# EAGLE design ClockBoard (EAGLE 7.5.0)
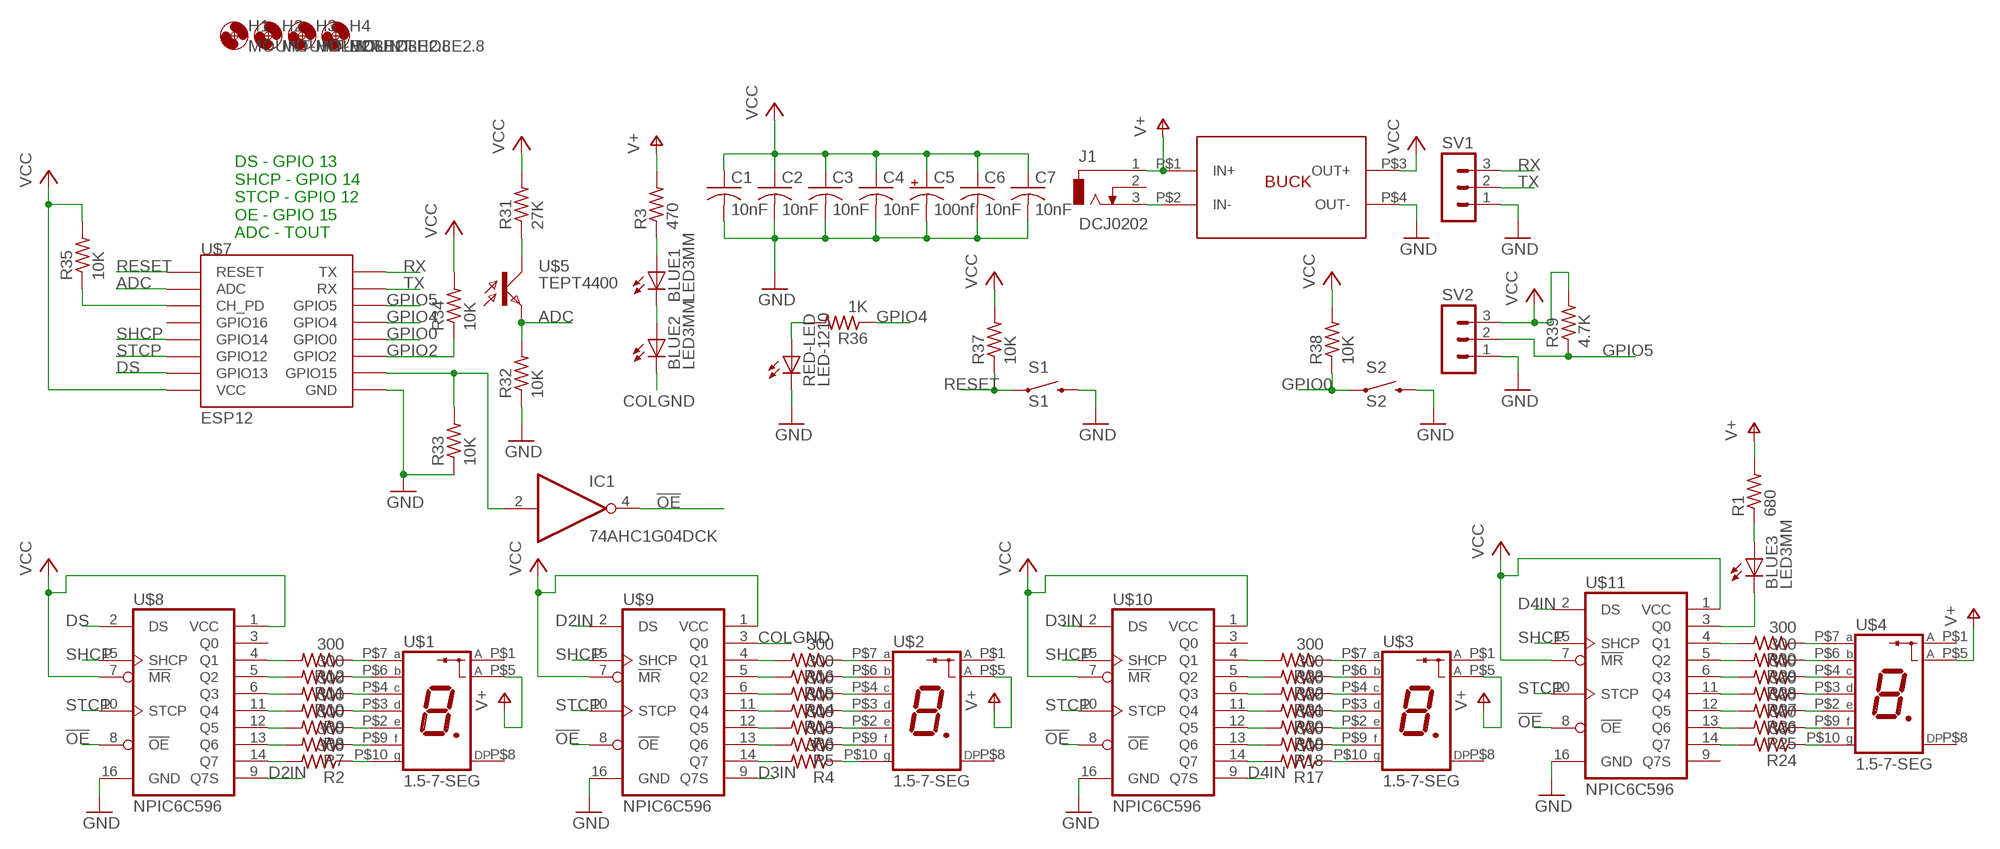
[diagram p0: schematic, sheet 1]

## Parts
B1  BUCK_CONV  [BUCK_CONV]
BLUE1  LED3MM  [LED3MM]
BLUE2  LED3MM  [LED3MM]
BLUE3  LED3MM  [LED3MM]
C1  10nF  C-USC0805K  [C0805K]
C2  10nF  C-USC0805K  [C0805K]
C3  10nF  C-USC0805K  [C0805K]
C4  10nF  C-USC0805K  [C0805K]
C5  100nf  CPOL-USE5-4  [E5-4]
C6  10nF  C-US050-025X075  [C050-025X075]
C7  10nF  C-USC0805K  [C0805K]
H1  MOUNT-HOLE2.8  [2,8]
H2  MOUNT-HOLE2.8  [2,8]
H3  MOUNT-HOLE2.8  [2,8]
H4  MOUNT-HOLE2.8  [2,8]
IC1  74AHC1G04DCK  [SC70-5]
J1  DCJ0202  [DCJ0202]
R1  680  R-US_M0805  [M0805]
R2  300  R-US_M0805  [M0805]
R3  470  R-US_M0805  [M0805]
R4  300  R-US_M0805  [M0805]
R5  300  R-US_M0805  [M0805]
R6  300  R-US_M0805  [M0805]
R7  300  R-US_M0805  [M0805]
R8  300  R-US_M0805  [M0805]
R9  300  R-US_M0805  [M0805]
R10  300  R-US_M0805  [M0805]
R11  300  R-US_M0805  [M0805]
R12  300  R-US_M0805  [M0805]
R13  300  R-US_M0805  [M0805]
R14  300  R-US_M0805  [M0805]
R15  300  R-US_M0805  [M0805]
R16  300  R-US_M0805  [M0805]
R17  300  R-US_M0805  [M0805]
R18  300  R-US_M0805  [M0805]
R19  300  R-US_M0805  [M0805]
R20  300  R-US_M0805  [M0805]
R21  300  R-US_M0805  [M0805]
R22  300  R-US_M0805  [M0805]
R23  300  R-US_M0805  [M0805]
R24  300  R-US_M0805  [M0805]
R25  300  R-US_M0805  [M0805]
R26  300  R-US_M0805  [M0805]
R27  300  R-US_M0805  [M0805]
R28  300  R-US_M0805  [M0805]
R29  300  R-US_M0805  [M0805]
R30  300  R-US_M0805  [M0805]
R31  27K  R-US_M0805  [M0805]
R32  10K  R-US_M0805  [M0805]
R33  10K  R-US_M0805  [M0805]
R34  10K  R-US_M0805  [M0805]
R35  10K  R-US_M0805  [M0805]
R36  1K  R-US_M0805  [M0805]
R37  10K  R-US_M0805  [M0805]
R38  10K  R-US_M0805  [M0805]
R39  4.7K  R-US_M0805  [M0805]
RED-LED  LED-1210  [C1210K]
S1  S1  SWITCH-MOMENTARY-2PTH  [TACTILE-PTH]
S2  S2  SWITCH-MOMENTARY-2PTH  [TACTILE-PTH]
SV1  MA03-1  [MA03-1]
SV2  MA03-1  [MA03-1]
U$1  1.5-7-SEG  [1.5-7-SEG]
U$2  1.5-7-SEG  [1.5-7-SEG]
U$3  1.5-7-SEG  [1.5-7-SEG]
U$4  1.5-7-SEG  [1.5-7-SEG]
U$5  TEPT4400  [T1]
U$7  ESP12  [ESP12]
U$8  NPIC6C596  [SO16]
U$9  NPIC6C596  [SO16]
U$10  NPIC6C596  [SO16]
U$11  NPIC6C596  [SO16]

## Nets
!OE: IC1.4(O) U$8.8(!OE) U$9.8(!OE) U$10.8(!OE) U$11.8(!OE)
ADC: R32.2 U$5.A(E) U$7.ADC
COLGND: BLUE2.K(C) U$9.3(Q0)
D2IN: U$8.9(Q7S) U$9.2(DS)
D3IN: U$9.9(Q7S) U$10.2(DS)
D4IN: U$10.9(Q7S) U$11.2(DS)
DS: U$7.GPIO13 U$8.2(DS)
GND: B1.P$4(OUT-) C1.2 C2.2 C3.2 C4.2 C5.- C6.2 C7.2 R32.1 R33.1 RED-LED.2(C) S1.3 S2.3 SV1.1 SV2.1 U$7.GND U$8.16(GND) U$9.16(GND) U$10.16(GND) U$11.16(GND)
GPIO0: R38.1 S2.1 U$7.GPIO0
GPIO2: R34.1 U$7.GPIO2
GPIO4: R36.1 U$7.GPIO4
GPIO5: R39.1 SV2.2 U$7.GPIO5
N$1: R12.2 U$8.4(Q1)
N$2: BLUE3.A R1.1
N$3: BLUE1.A R3.1
N$4: BLUE1.K(C) BLUE2.A
N$5: R12.1 U$1.P$7(A)
N$6: R11.2 U$8.5(Q2)
N$7: R11.1 U$1.P$6(B)
N$8: R10.2 U$8.6(Q3)
N$9: R10.1 U$1.P$4(C)
N$10: R9.2 U$8.11(Q4)
N$11: R9.1 U$1.P$3(D)
N$12: R8.2 U$8.12(Q5)
N$13: R8.1 U$1.P$2(E)
N$14: R7.2 U$8.13(Q6)
N$15: R7.1 U$1.P$9(F)
N$16: R2.2 U$8.14(Q7)
N$17: R2.1 U$1.P$10(G)
N$18: R23.2 U$10.4(Q1)
N$19: R16.1 U$2.P$7(A)
N$20: R22.2 U$10.5(Q2)
N$21: R31.1 U$5.K(C)
N$22: R15.1 U$2.P$6(B)
N$23: R21.2 U$10.6(Q3)
N$24: R14.1 U$2.P$4(C)
N$25: R16.2 U$9.4(Q1)
N$26: R13.1 U$2.P$3(D)
N$27: R15.2 U$9.5(Q2)
N$28: R6.1 U$2.P$2(E)
N$29: R14.2 U$9.6(Q3)
N$30: R5.1 U$2.P$9(F)
N$31: R13.2 U$9.11(Q4)
N$32: R4.1 U$2.P$10(G)
N$33: R20.2 U$10.11(Q4)
N$34: R23.1 U$3.P$7(A)
N$35: R19.2 U$10.12(Q5)
N$36: R22.1 U$3.P$6(B)
N$37: R18.2 U$10.13(Q6)
N$38: R21.1 U$3.P$4(C)
N$39: R17.2 U$10.14(Q7)
N$40: R20.1 U$3.P$3(D)
N$41: R30.2 U$11.4(Q1)
N$42: R19.1 U$3.P$2(E)
N$43: R29.2 U$11.5(Q2)
N$44: R18.1 U$3.P$9(F)
N$45: R28.2 U$11.6(Q3)
N$46: R17.1 U$3.P$10(G)
N$47: R27.2 U$11.11(Q4)
N$48: R30.1 U$4.P$7(A)
N$49: R26.2 U$11.12(Q5)
N$50: R29.1 U$4.P$6(B)
N$51: R25.2 U$11.13(Q6)
N$52: R28.1 U$4.P$4(C)
N$53: R24.2 U$11.14(Q7)
N$54: R27.1 U$4.P$3(D)
N$56: R26.1 U$4.P$2(E)
N$57: R36.2 RED-LED.1(A)
N$58: R25.1 U$4.P$9(F)
N$59: B1.P$2(IN-) J1.3
N$60: R24.1 U$4.P$10(G)
N$61: BLUE3.K(C) U$11.3(Q0)
N$62: R6.2 U$9.12(Q5)
N$63: R5.2 U$9.13(Q6)
N$64: R4.2 U$9.14(Q7)
N$65: IC1.2(I) R33.2 U$7.GPIO15
N$68: R35.1 U$7.CH_PD
RESET: R37.1 S1.1 U$7.RESET
RX: SV1.3 U$7.TX
SHCP: U$7.GPIO14 U$8.15(SHCP) U$9.15(SHCP) U$10.15(SHCP) U$11.15(SHCP)
STCP: U$7.GPIO12 U$8.10(STCP) U$9.10(STCP) U$10.10(STCP) U$11.10(STCP)
TX: SV1.2 U$7.RX
V+: B1.P$1(IN+) J1.1 R1.2 R3.2 U$1.P$5(A) U$2.P$5(A) U$3.P$5(A) U$4.P$5(A)
VCC: B1.P$3(OUT+) C1.1 C2.1 C3.1 C4.1 C5.+ C6.1 C7.1 R31.2 R34.2 R35.2 R37.2 R38.2 R39.2 SV2.3 U$7.VCC U$8.1(VCC) U$8.7(!MR) U$9.1(VCC) U$9.7(!MR) U$10.1(VCC) U$10.7(!MR) U$11.1(VCC) U$11.7(!MR)
Unconnected: J1.2 U$1.P$1(A) U$1.P$8(DP) U$2.P$1(A) U$2.P$8(DP) U$3.P$1(A) U$3.P$8(DP) U$4.P$1(A) U$4.P$8(DP) U$7.GPIO16 U$8.3(Q0) U$10.3(Q0) U$11.9(Q7S)

## Notes on the sheet
- DS - GPIO 13
  SHCP - GPIO 14
  STCP - GPIO 12
  OE - GPIO 15
  ADC - TOUT

## Power pins joined to a net without a drawn wire
GND: IC1.3(GND)
VCC: IC1.5(VCC)

## Library data of the parts
B1 = KevinsLib:BUCK_CONV
BLUE1-BLUE3 = KevinsLib:LED3MM
C1-C4 C6 C7 = rcl:C-US: CAPACITOR, American symbol
C5 = rcl:CPOL-US: POLARIZED CAPACITOR, American symbol
H1-H4 = holes:MOUNT-HOLE: MOUNTING HOLE with drill center marker
IC1 = 74xx-little-us:74*1G04: INVERTER Gate
J1 = con-jack:DCJ0202: DC POWER JACK Source: DCJ0202.pdf; OC_FARNELL: unknown; OC_NEWARK: unknown
R1-R39 = rcl:R-US_: RESISTOR, American symbol
RED-LED = KevinsLib:LED-1210
S1 S2 = KevinsLib:SWITCH-MOMENTARY-2: Various NO switches- pushbuttons, reed, etc
SV1 SV2 = con-lstb:MA03-1: PIN HEADER; OC_FARNELL: unknown; OC_NEWARK: unknown
U$1-U$4 = KevinsLib:1.5-7-SEG
U$5 = KevinsLib:TEPT4400
U$7 = KevinsLib:ESP12: ESP8266 Wifi module 12
U$8-U$11 = KevinsLib:NPIC6C596

## Board
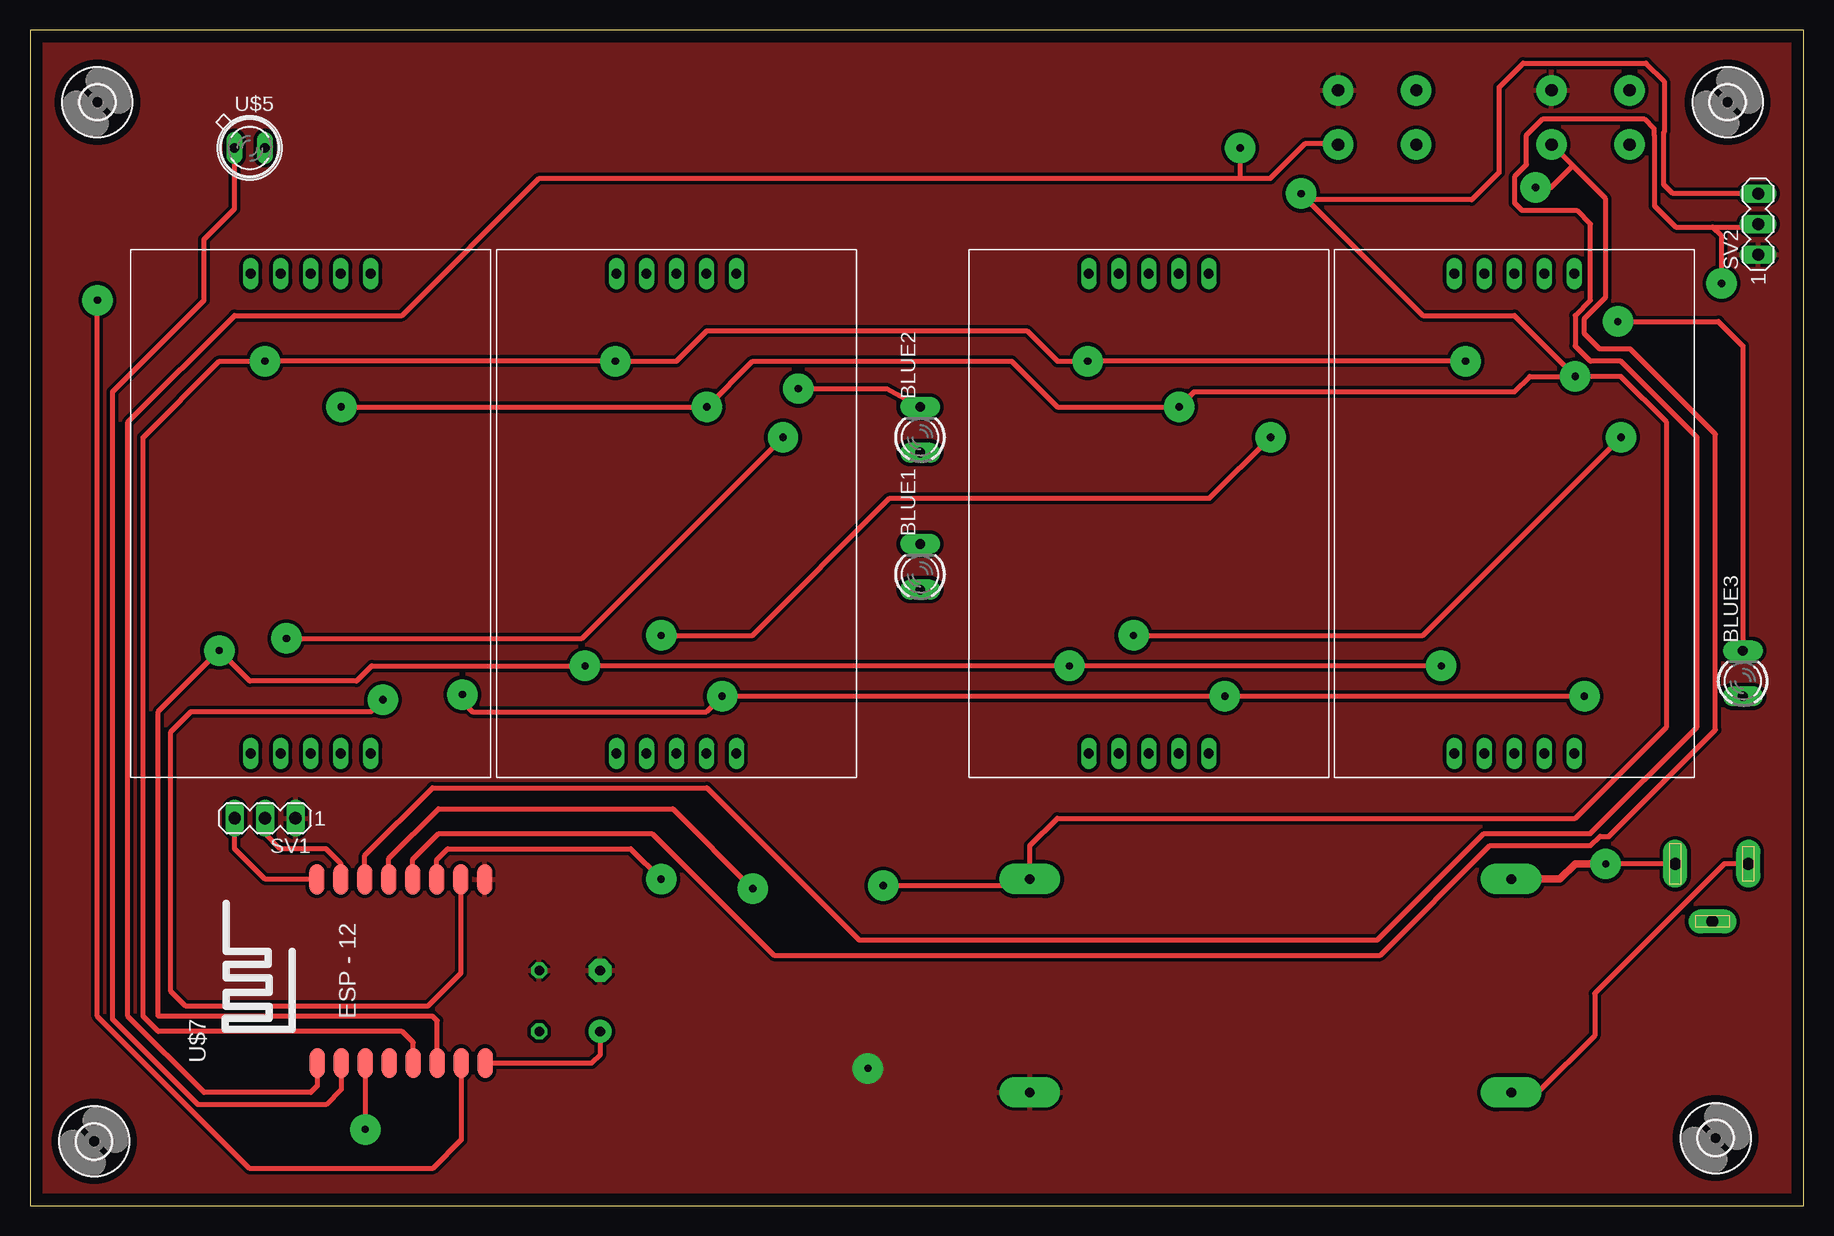
[diagram p1: board, top side]
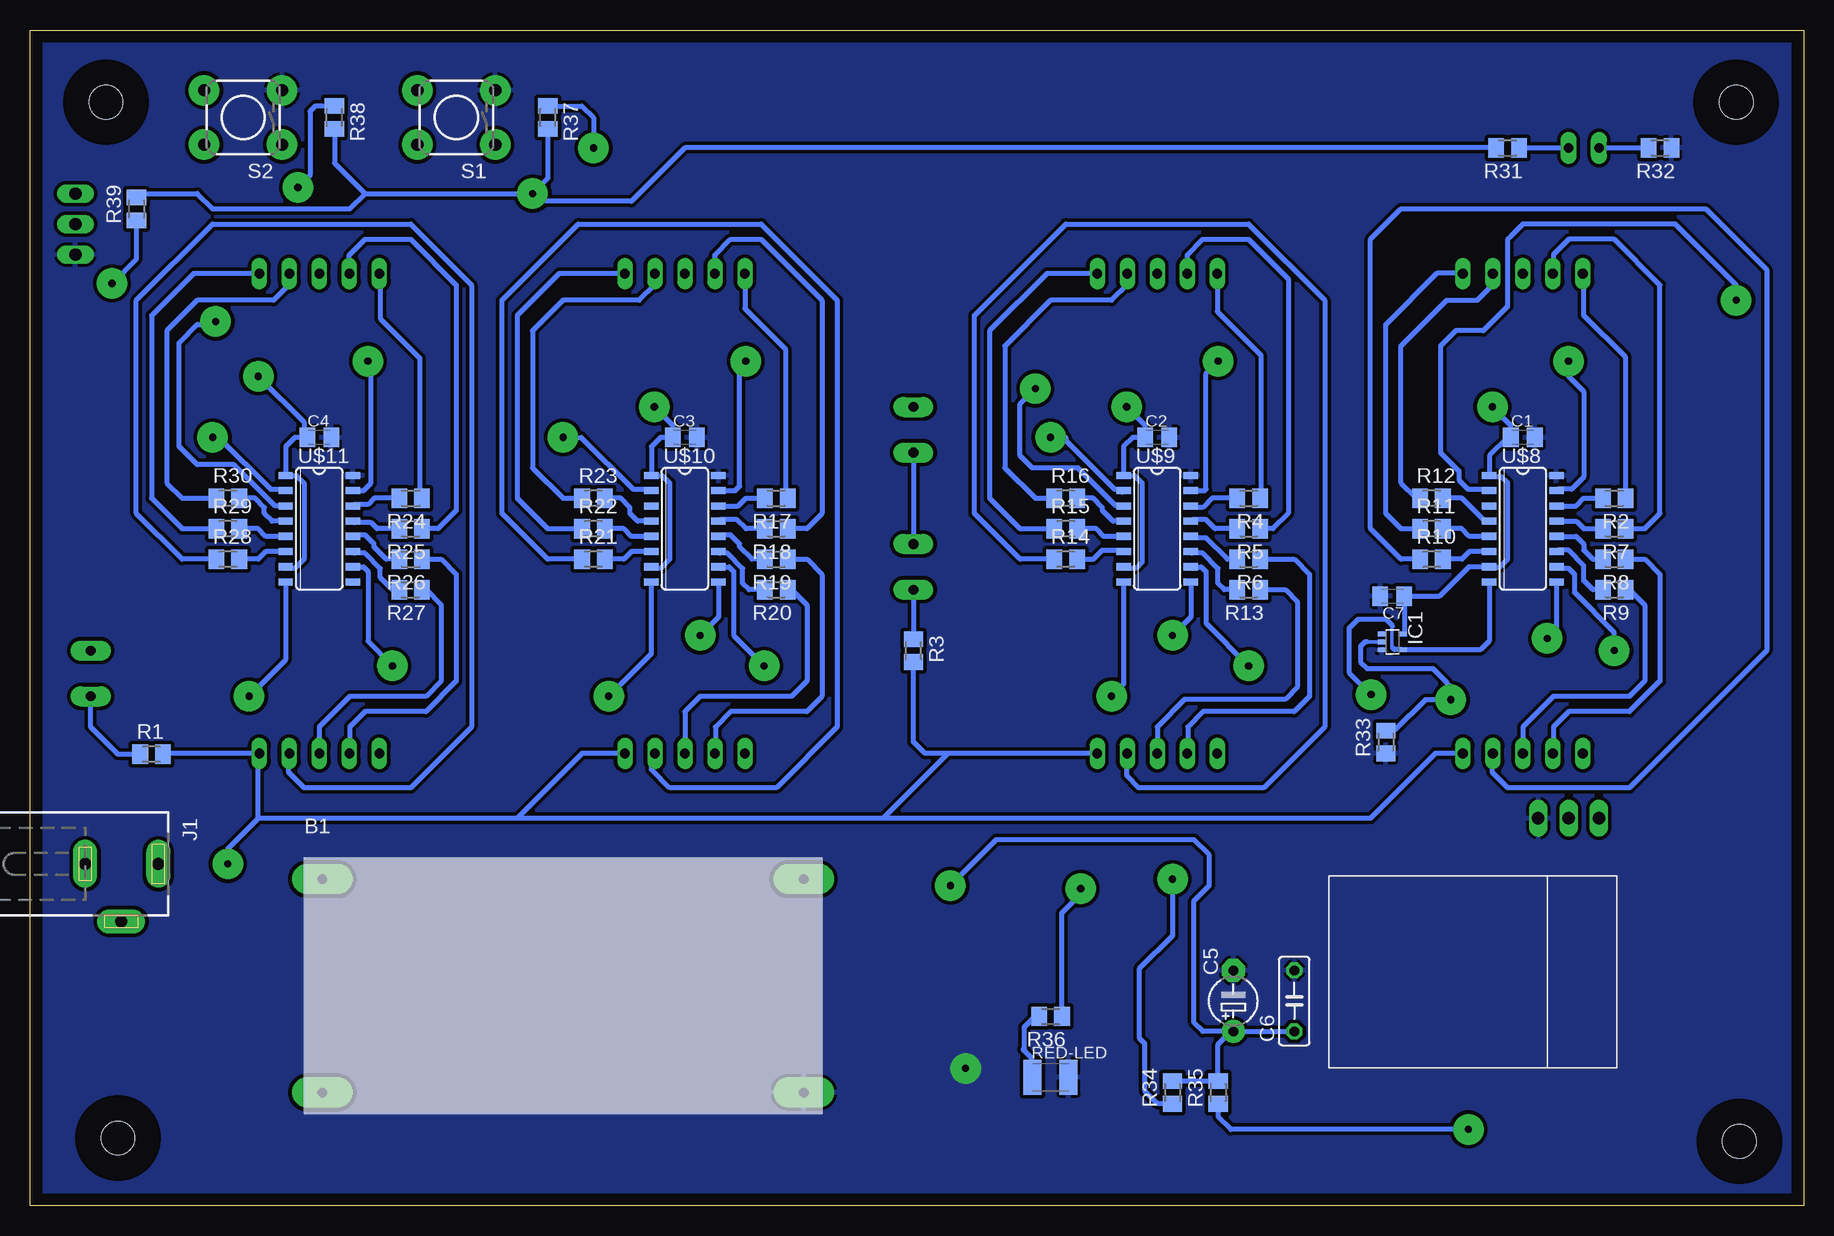
[diagram p2: board, bottom side, seen from below]

Size 147.84 x 98 mm. Coordinates in mm from the lower left corner, seen from the top.
Outline: 0,0 147.84,0 147.84,98 0,98 0,0
Copper layers (1*16): Top 0.035mm / dielectric 1.5mm / Bottom 0.035mm
Design rules "default *": minimum track width 10mil, minimum drill 20mil, track to track 12mil, track to pad 12mil, pad to pad 12mil, via to via 12mil, smd to smd 12mil, copper to edge 40mil, drill to drill 8mil, minimum pad ring 10mil, minimum via ring 8mil, stop-mask expansion 4mil, vias tented up to drill 0mil, thermal gap 10mil

### Footprints (pad centres in the part's own frame; a part is rotated, then mirrored left to right if it is on the bottom)
BUCK_CONV = drill 0.8 pad 2.54 long: P$1 -20.066,8.89; P$2 -20.066,-8.89; P$3 20.066,8.89; P$4 20.066,-8.89
LED3MM = drill 0.813 pad 1.676 long: A -1.27,0; K 2.54,0
C0805K = smd 1.3 x 1.6: 1 -1,0; 2 1,0
E5-4 = drill 0.813 pad 1.905: + -2.54,0 | drill 0.813 pad 1.905 octagon: - 2.54,0
C050-025X075 = drill 0.813 octagon: 1 -2.54,0; 2 2.54,0
2,8 = hole 2.8: 0,0
SC70-5 = smd 0.4 x 0.7: 1 -0.65,-0.85; 2 0,-0.85; 3 0.65,-0.85; 4 0.65,0.85; 5 -0.65,0.85
DCJ0202 = drill 1 pad 2 long: 1 0,3.1; 2 4.8,0; 3 0,-3
M0805 = smd 1.3 x 1.6: 1 -0.95,0; 2 0.95,0
C1210K = smd 1.5 x 2.9: 1 -1.5,0; 2 1.5,0
TACTILE-PTH = drill 1.016 pad 2.54: 1 -3.251,2.261; 2 3.251,2.261; 3 -3.251,-2.261; 4 3.251,-2.261
MA03-1 = drill 1.016 long: 1 -2.54,0; 2 0,0; 3 2.54,0
1.5-7-SEG = drill 0.8 long: P$1 -5,-20; P$2 -2.5,-20; P$3 0,-20; P$4 2.5,-20; P$5 5,-20; P$6 5,20; P$7 2.5,20; P$8 0,20; P$9 -2.5,20; P$10 -5,20
T1 = drill 0.813 long: A -1.27,0; K 1.27,0
ESP12 = smd 2.54 x 1.27: ADC -7.71,3.81; CH_PD -7.71,1.81; GND 7.6,-8.16; GPIO0 7.6,-2.16; GPIO2 7.6,-4.16; GPIO4 7.6,-0.16; GPIO5 7.6,1.84; GPIO12 -7.71,-4.19; GPIO13 -7.71,-6.19; GPIO14 -7.71,-2.19; GPIO15 7.6,-6.16; GPIO16 -7.71,-0.19; RESET -7.71,5.81; RX 7.6,3.84; TX 7.6,5.84; VCC -7.71,-8.19
SO16 = smd 0.6 x 1.2: 1 -4.445,-2.8; 2 -3.175,-2.8; 3 -1.905,-2.8; 4 -0.635,-2.8; 5 0.635,-2.8; 6 1.905,-2.8; 7 3.175,-2.8; 8 4.445,-2.8; 9 4.445,2.8; 10 3.175,2.8; 11 1.905,2.8; 12 0.635,2.8; 13 -0.635,2.8; 14 -1.905,2.8; 15 -3.175,2.8; 16 -4.445,2.8

### Placement (x,y rotation side)
B1  103.41,18.32 0 bottom
BLUE1  74.2,52.61 90 top
BLUE2  74.2,64.04 90 top
BLUE3  142.78,43.72 90 top
C1  23.4,64.04 0 bottom
C2  53.88,64.04 0 bottom
C3  93.25,64.04 0 bottom
C4  123.73,64.04 0 bottom
C5  47.53,17.05 90 bottom
C6  42.45,17.05 90 bottom
C7  34.29,50.8 180 bottom
H1  5.62,91.98 0 top
H2  141.51,91.98 0 top
H3  5.35,5.35 0 top
H4  140.51,5.62 0 top
IC1  34.29,46.99 270 bottom
J1  140.24,28.48 270 bottom
R1  137.7,37.62 0 bottom
R2  15.78,58.96 180 bottom
R3  74.2,46.26 270 bottom
R4  46.26,58.96 180 bottom
R5  46.26,56.42 180 bottom
R6  46.26,53.88 180 bottom
R7  15.78,56.42 180 bottom
R8  15.78,53.88 180 bottom
R9  15.78,51.34 180 bottom
R10  31.02,53.88 0 bottom
R11  31.02,56.42 0 bottom
R12  31.02,58.96 0 bottom
R13  46.26,51.34 180 bottom
R14  61.5,53.88 0 bottom
R15  61.5,56.42 0 bottom
R16  61.5,58.96 0 bottom
R17  85.63,58.96 180 bottom
R18  85.63,56.42 180 bottom
R19  85.63,53.88 180 bottom
R20  85.63,51.34 180 bottom
R21  100.87,53.88 0 bottom
R22  100.87,56.42 0 bottom
R23  100.87,58.96 0 bottom
R24  116.11,58.96 180 bottom
R25  116.11,56.42 180 bottom
R26  116.11,53.88 180 bottom
R27  116.11,51.34 180 bottom
R28  131.35,53.88 0 bottom
R29  131.35,56.42 0 bottom
R30  131.35,58.96 0 bottom
R31  24.67,88.17 180 bottom
R32  11.97,88.17 180 bottom
R33  34.83,38.64 90 bottom
R34  52.61,9.43 90 bottom
R35  48.8,9.43 90 bottom
R36  62.77,15.78 180 bottom
R37  104.68,90.71 270 bottom
R38  122.46,90.71 270 bottom
R39  138.97,83.09 90 bottom
RED-LED  62.77,10.7 0 bottom
S1  112.3,90.71 180 bottom
S2  130.08,90.71 180 bottom
SV1  19.59,32.29 180 top
SV2  144.05,81.82 90 top
U$1  23.4,57.69 0 top
U$2  53.88,57.69 0 top
U$3  93.25,57.69 0 top
U$4  123.73,57.69 0 top
U$5  18.32,88.17 0 top
U$7  29.75,19.59 90 top
U$8  23.4,56.42 270 bottom
U$9  53.88,56.42 270 bottom
U$10  93.25,56.42 270 bottom
U$11  123.73,56.42 270 bottom

### Tracks (layer width: path | path; a pad name or v marks a point on that pad's centre or on a via)
!OE  (via drill 0.6 pad 2.54)
  Top 0.406: v129.57,42.45 v99.6,42.45 v57.69,42.45 56.39,41.15 36.88,41.15 36.04,41.99 v36.04,42.6
  Bottom 0.305: 34.24,46.48 34.24,46.51 34.31,46.58 34.31,48.23 34.24,48.31
  Bottom 0.406: U$9.8 56.68,43.46 v57.69,42.45 | U$10.8 96.05,46 v99.6,42.45 | U$11.8 126.53,45.49 v129.57,42.45 | 34.24,46.48 34.1,46.34 IC1.4 26.95,46.33 26.2,47.08 U$8.8 | 34.24,48.31 34.8,48.87 37.13,48.87 37.9,48.11 37.9,44.45 v36.04,42.6
ADC
  Top 0.406: 25.94,11.97 U$7.ADC 25.94,9.68 24.67,8.41 14,8.41 6.89,15.53 6.89,67.85 14.51,75.47 14.51,80.55 17.05,83.09 U$5.A
  Bottom 0.406: U$5.A R32.2
COLGND  (via drill 0.6 pad 2.54)
  Top 0.406: v64.04,68.1 71.41,68.1 BLUE2.K
  Bottom 0.406: U$9.3 57.31,58.33 60.48,61.5 64.29,61.5 65.31,62.52 65.31,66.83 v64.04,68.1
D2IN  (via drill 0.6 pad 2.54)
  Top 0.406: v21.37,47.28 46.01,47.28 v62.77,64.04
  Bottom 0.406: U$8.9 20.6,48.04 v21.37,47.28 | 56.81,59.47 U$9.2 56.81,59.72 57.44,59.72 61.5,63.79 61.5,64.04 v62.77,64.04
D3IN  (via drill 0.6 pad 2.54)
  Top 0.406: v52.61,47.53 60.23,47.53 71.66,58.96 98.33,58.96 v103.41,64.04
  Bottom 0.406: U$9.9 51.08,49.06 v52.61,47.53 | v103.41,64.04 101.89,64.04 97.57,59.72 96.18,59.72 U$10.2
D4IN  (via drill 0.6 pad 2.54)
  Top 0.406: v91.98,47.53 116.11,47.53 v132.62,64.04
  Bottom 0.406: U$10.9 90.45,49.06 v91.98,47.53 | v132.62,64.04 132.11,64.04 127.79,59.72 126.66,59.72 U$11.2
DS  (via drill 0.6 pad 2.54)
  Top 0.406: U$7.GPIO13 35.94,5.46 33.56,3.08 18.32,3.08 5.62,15.78 v5.62,75.47
  Bottom 0.406: v5.62,75.47 5.62,76.74 10.7,81.82 23.4,81.82 24.42,80.8 24.42,80.79 24.69,80.52 24.69,74.94 26.7,72.93 28.99,72.93 30.26,71.66 30.26,62.77 28.73,61.25 28.73,60.48 27.97,59.72 26.33,59.72 U$8.2
GND  (via drill 0.6 pad 2.54)
  other vias: 69.85,11.43
  pour Top: 0,0 147.32,0 147.32,97.79 0,97.79
  pour Bottom: 0,0 0,97.79 147.32,97.79 147.32,0
GPIO0  (via drill 0.6 pad 2.54)
  Top 0.406: U$7.GPIO0 31.91,28.86 34.07,31.02 51.85,31.02 62.01,20.86 112.55,20.86 121.7,30 130.08,30 130.86,30.79 131.67,30.79 131.67,30.84 140.49,39.66 140.49,64.29 133.38,71.41 130.84,71.41 129.57,72.68 129.57,73.95 131.35,75.72 131.35,83.93 128.59,86.68 | 128.59,86.68 S2.1 | v125.51,84.87 126.78,84.87 128.59,86.68
  Bottom 0.406: R38.1 124.05,91.66 124.49,91.22 124.49,85.88 v125.51,84.87
GPIO2  (via drill 0.6 pad 2.54)
  Top 0.406: U$7.GPIO2 33.91,28.83 34.83,29.75 50.07,29.75 v52.61,27.21
  Bottom 0.406: v52.61,27.21 52.61,22.5 55.4,19.71 55.4,13.99 54.94,13.54 54.94,9.58 53.9,8.53 52.66,8.53 R34.1
GPIO4  (via drill 0.6 pad 2.54)
  Top 0.406: U$7.GPIO4 29.91,28.92 34.06,33.07 53.59,33.07 v60.25,26.42
  Bottom 0.406: v60.25,26.42 60.25,25.96 61.85,24.36 61.85,15.81 R36.1
GPIO5  (via drill 0.6 pad 2.54)
  Top 0.406: U$7.GPIO5 27.91,29.18 33.56,34.83 56.42,34.83 69.12,22.13 112.3,22.13 121.19,31.02 130.08,31.02 138.97,39.91 138.97,64.04 132.62,70.39 130.08,70.39 128.81,71.66 128.81,74.2 130.08,75.47 130.08,81.82 128.94,82.96 124.36,82.96 123.73,83.6 123.73,85.76 124.75,86.77 124.75,89.24 126.11,90.6 134.54,90.6 135.36,89.79 135.36,89.24 135.41,89.19 135.41,83.34 137.19,81.57 140.24,81.57 | 140.24,81.57 143.8,81.57 SV2.2 | v141,76.87 141,80.8 140.24,81.57
  Bottom 0.406: R39.1 138.97,78.9 v141,76.87
N$1
  Bottom 0.406: U$8.4 26.57,57.05 28.48,58.96 R12.2
N$2
  Bottom 0.406: R1.1 140.49,37.62 142.78,39.91 BLUE3.A
N$3
  Bottom 0.406: BLUE1.A R3.1
N$4
  Bottom 0.406: BLUE2.A BLUE1.K
N$5
  Bottom 0.406: R12.1 32.29,58.96 33.56,60.23 33.56,71.66 29.75,75.47 27.21,75.47 25.94,76.74 25.94,77.65 U$1.P$7
N$6
  Bottom 0.406: U$8.5 27.84,55.78 28.48,56.42 R11.2
N$7
  Bottom 0.406: R11.1 33.56,56.42 34.83,57.69 34.83,73.44 30.51,77.76 28.47,77.76 U$1.P$6
N$8
  Bottom 0.406: U$8.6 27.84,54.52 28.48,53.88 R10.2
N$9
  Bottom 0.406: R10.1 33.56,53.88 36.1,56.42 36.1,80.55 33.56,83.09 8.16,83.09 3.08,78.01 3.08,46.26 14.51,34.83 24.67,34.83 25.94,36.1 25.94,37.65 U$1.P$4
N$10
  Bottom 0.406: 20.23,54.52 U$8.11 20.47,54.64 19.59,54.64 18.32,53.37 18.32,52.1 17.56,51.34 R9.2
N$11
  Bottom 0.406: R9.1 14.51,51.34 13.24,50.07 13.24,43.72 14.51,42.45 20.86,42.45 23.4,39.91 U$1.P$3
N$12
  Bottom 0.406: U$8.12 18.95,55.78 18.32,55.15 18.32,54.64 17.56,53.88 R8.2
N$13
  Bottom 0.406: R8.1 13.24,53.88 11.97,52.61 11.97,43.72 14.51,41.18 19.59,41.18 20.86,39.91 20.86,37.73 U$1.P$2
N$14
  Bottom 0.406: U$8.13 18.95,57.05 18.32,56.42 R7.2
N$15
  Bottom 0.406: R7.1 13.24,56.42 11.97,57.69 11.97,76.74 15.78,80.55 19.59,80.55 20.86,79.28 20.86,77.73 U$1.P$9
N$16
  Bottom 0.406: U$8.14 18.95,58.33 18.32,58.96 R2.2
N$17
  Bottom 0.406: R2.1 14.83,70.71 18.32,74.2 18.32,77.61 U$1.P$10
N$18
  Bottom 0.406: U$10.4 97.19,57.05 97.82,57.69 97.82,58.2 98.58,58.96 R23.2
N$19
  Bottom 0.406: U$2.P$7 56.38,76.78 57.69,75.47 62.77,75.47 66.58,71.66 66.58,61.5 64.04,58.96 R16.1
N$20
  Bottom 0.406: U$10.5 97.69,55.78 98.33,56.42 R22.2
N$21
  Bottom 0.406: R31.1 U$5.K
N$22
  Bottom 0.406: U$2.P$6 63.09,77.69 67.85,72.93 67.85,58.96 65.31,56.42 R15.1
N$23
  Bottom 0.406: U$10.6 97.69,54.52 98.33,53.88 R21.2
N$24
  Bottom 0.406: R14.1 65.31,53.88 69.12,57.69 69.12,74.2 61.5,81.82 46.26,81.82 39.91,75.47 39.91,39.91 44.99,34.83 55.4,34.83 56.42,35.85 56.42,37.65 U$2.P$4
N$25
  Bottom 0.406: U$9.4 57.56,57.05 58.45,57.94 58.45,58.2 59.21,58.96 R16.2
N$26
  Bottom 0.406: R13.1 43.21,51.34 42.2,50.32 42.2,43.21 43.21,42.2 51.59,42.2 53.88,39.91 U$2.P$3
N$27
  Bottom 0.406: U$9.5 58.33,55.78 58.96,56.42 R15.2
N$28
  Bottom 0.406: R6.1 42.45,53.88 41.18,52.61 41.18,42.45 42.45,41.18 50.07,41.18 51.34,39.91 51.34,37.73 U$2.P$2
N$29
  Bottom 0.406: R14.2 59.21,53.88 58.45,54.64 56.81,54.64 U$9.6
N$30
  Bottom 0.406: U$2.P$9 51.38,79.24 50.07,80.55 46.26,80.55 42.96,77.25 42.96,57.69 44.23,56.42 R5.1
N$31
  Bottom 0.406: R13.2 48.29,51.34 48.8,51.85 48.8,53.12 50.07,54.39 50.95,54.39 U$9.11
N$32
  Bottom 0.406: U$2.P$10 48.88,74.53 45.24,70.9 45.24,59.03 R4.1
N$33
  Bottom 0.406: R20.2 87.92,51.34 88.42,51.85 88.42,53.12 89.69,54.39 90.32,54.39 U$10.11
N$34
  Bottom 0.406: U$3.P$7 95.75,76.78 97.06,75.47 103.41,75.47 105.95,72.93 105.95,61.5 103.41,58.96 R23.1
N$35
  Bottom 0.406: R19.2 87.66,53.88 88.68,54.9 88.68,55.15 89.44,55.91 90.32,55.91 U$10.12
N$36
  Bottom 0.406: U$3.P$6 103.73,77.69 107.22,74.2 107.22,58.96 104.68,56.42 R22.1
N$37
  Bottom 0.406: R18.2 88.17,56.42 88.93,57.18 90.32,57.18 U$10.13
N$38
  Bottom 0.406: R21.1 104.68,53.88 108.49,57.69 108.49,75.47 102.14,81.82 86.9,81.82 80.55,75.47 80.55,39.91 85.63,34.83 94.52,34.83 96.04,36.35 96.04,37.4 U$3.P$4
N$39
  Bottom 0.406: U$10.14 88.81,58.33 88.17,58.96 R17.2
N$40
  Bottom 0.406: R20.1 84.36,51.34 83.09,50.07 83.09,43.72 84.36,42.45 91.98,42.45 93.25,41.18 U$3.P$3
N$41
  Bottom 0.406: U$11.4 127.67,57.05 128.3,57.69 128.3,58.2 129.06,58.96 R30.2
N$42
  Bottom 0.406: R19.1 83.09,53.88 81.82,52.61 81.82,42.45 83.09,41.18 89.44,41.18 90.71,39.91 90.71,37.73 U$3.P$2
N$43
  Bottom 0.406: U$11.5 128.18,55.78 128.81,56.42 R29.2
N$44
  Bottom 0.406: U$3.P$9 90.75,79.24 89.44,80.55 86.9,80.55 81.82,75.47 81.82,57.69 83.09,56.42 R18.1
N$45
  Bottom 0.406: U$11.6 128.18,54.52 128.81,53.88 R28.2
N$46
  Bottom 0.406: U$3.P$10 88.25,74.79 84.87,71.41 84.87,59.15 R17.1
N$47
  Bottom 0.406: R27.2 117.63,51.34 118.65,52.36 118.65,53.12 119.92,54.39 120.8,54.39 U$11.11
N$48
  Bottom 0.406: U$4.P$7 126.23,76.78 127.54,75.47 133.89,75.47 136.43,72.93 136.43,60.23 135.16,58.96 R30.1
N$49
  Bottom 0.406: R26.2 118.14,53.88 119.16,54.9 119.16,55.15 119.92,55.91 120.8,55.91 U$11.12
N$50
  Bottom 0.406: U$4.P$6 134.21,77.69 137.7,74.2 137.7,58.96 135.16,56.42 R29.1
N$51
  Bottom 0.406: R25.2 118.9,56.42 119.41,56.93 120.8,56.93 U$11.13
N$52
  Bottom 0.406: R28.1 135.16,53.88 138.97,57.69 138.97,75.47 132.62,81.82 116.11,81.82 111.03,76.74 111.03,39.91 116.11,34.83 125,34.83 126.27,36.1 126.27,37.73 | 126.27,38.64 126.27,37.73 | 126.27,37.73 U$4.P$4
N$53
  Bottom 0.406: R24.2 119.16,58.96 119.67,58.45 120.8,58.45 U$11.14
N$54
  Bottom 0.406: R27.1 114.84,51.34 113.57,50.07 113.57,43.72 114.84,42.45 121.19,42.45 123.73,39.91 U$4.P$3
N$56
  Bottom 0.406: R26.1 113.57,53.88 112.3,52.61 112.3,43.72 114.84,41.18 119.92,41.18 121.19,39.91 121.19,37.73 U$4.P$2
N$57
  Bottom 0.406: R36.2 64.05,15.78 64.97,14.86 64.97,13.11 65.05,13.03 65.05,13.01 64.36,12.32 64.36,10.79 RED-LED.1
N$58
  Bottom 0.406: U$4.P$9 121.23,79.24 119.92,80.55 116.11,80.55 112.3,76.74 112.3,57.94 113.82,56.42 R25.1
N$59
  Top 0.406: 125.27,9.88 123.93,9.88 B1.P$2 123.6,9.55 125.83,9.55 130.43,14.15 130.43,17.68 141.23,28.48 J1.3
N$60
  Bottom 0.406: U$4.P$10 118.73,76.82 118.65,76.74 118.65,73.95 115.35,70.64 115.35,59.15 R24.1
N$61  (via drill 0.6 pad 2.54)
  Top 0.406: v132.37,73.69 140.75,73.69 142.78,71.66 BLUE3.K
  Bottom 0.406: U$11.3 127.41,58.33 130.84,61.75 133.89,61.75 135.41,63.28 135.41,71.91 133.89,73.44 132.62,73.44 v132.37,73.69
N$62
  Bottom 0.406: R6.2 48.04,53.88 49.82,55.66 50.95,55.66 U$9.12
N$63
  Bottom 0.406: R5.2 49.05,56.42 49.82,57.18 50.95,57.18 U$9.13
N$64
  Bottom 0.406: R4.2 49.31,58.96 50.07,58.2 50.95,58.2 U$9.14
N$65  (via drill 0.6 pad 2.54)
  Top 0.406: U$7.GPIO15 35.91,19.38 33.15,16.61 12.98,16.61 11.73,17.86 11.73,39.47 13.44,41.17 28.42,41.17 v29.41,42.16
  Bottom 0.305: IC1.2 36.37,46.99
  Bottom 0.406: R33.2 34.11,39.6 31.55,42.16 v29.41,42.16 29.41,43.26 29.77,43.61 29.77,43.64 30.89,44.76 36.37,44.76 36.93,45.31 36.93,46.61 36.55,46.99 36.37,46.99
N$68  (via drill 0.6 pad 2.54)
  Top 0.406: U$7.CH_PD v27.94,6.35
  Bottom 0.406: v27.94,6.35 47.75,6.35 48.77,7.37 48.77,8.45 R35.1
RESET  (via drill 0.6 pad 2.54)
  Top 0.406: U$7.RESET 23.94,9.97 23.4,9.43 14.51,9.43 8.16,15.78 8.16,65.31 17.05,74.2 31.02,74.2 42.45,85.63 100.87,85.63 | 100.87,85.63 103.41,85.63 106.33,88.55 108.95,88.55 S1.1 | v100.87,88.17 100.87,85.63
  Bottom 0.406: R37.1 101.82,91.66 100.87,90.71 v100.87,88.17
RX
  Top 0.406: U$7.TX 19.61,27.19 17.05,29.75 SV1.3
SHCP  (via drill 0.6 pad 2.54)
  Top 0.406: U$7.GPIO14 31.94,13.59 31.02,14.51 10.7,14.51 9.43,15.78 9.43,64.04 15.78,70.39 v19.59,70.39 v48.8,70.39 53.88,70.39 56.42,72.93 83.09,72.93 85.63,70.39 v88.17,70.39 v119.67,70.39
  Bottom 0.406: v19.59,70.39 19.59,69.12 18.32,67.85 18.32,60.74 19.34,59.72 20.47,59.72 U$8.15 | U$9.15 49.94,59.59 49.82,59.72 49.82,69.37 v48.8,70.39 | U$10.15 89.06,59.59 88.68,59.98 88.68,69.88 v88.17,70.39 | U$11.15 120.05,59.59 119.41,60.23 119.41,70.14 v119.67,70.39
STCP  (via drill 0.6 pad 2.54)
  Top 0.406: U$7.GPIO12 33.94,15.4 33.56,15.78 10.7,15.78 10.7,41.18 v15.78,46.26 18.32,43.72 27.21,43.72 28.48,44.99 v46.26,44.99 v86.65,44.99 v117.63,44.99
  Bottom 0.406: v15.78,46.26 15.78,47.78 19.08,51.09 19.08,52.61 19.59,53.12 20.47,53.12 U$8.10 | U$9.10 50.2,53.24 49.82,52.86 49.82,48.55 v46.26,44.99 | U$10.10 89.57,53.24 89.19,52.86 89.19,47.53 v86.65,44.99 | U$11.10 120.05,53.24 119.67,52.86 119.67,47.02 v117.63,44.99
TX
  Top 0.406: U$7.RX 25.91,28.51 24.67,29.75 20.86,29.75 19.59,31.02 SV1.2
V+  (via drill 0.6 pad 2.54)
  Top 0.406: J1.1 130.81,28.48
  Top 0.61: B1.P$1 127.54,27.21 128.81,28.48 130.81,28.48 v131.35,28.48
  Bottom 0.406: v131.35,28.48 131.35,29.75 128.81,32.29 | 128.81,32.29 128.81,37.61 U$4.P$5 136.68,37.69 R1.2 | U$3.P$5 101.82,37.69 107.22,32.29 | 107.22,32.29 128.81,32.29 | U$2.P$5 71.34,37.69 | 71.34,37.69 76.74,32.29 | 76.74,32.29 107.22,32.29 | 71.34,37.69 73.25,37.69 74.2,38.64 R3.2 | U$1.P$5 30.7,37.69 36.1,32.29 76.74,32.29
VCC  (via drill 0.6 pad 2.54)
  Top 0.406: v128.81,69.12 132.62,69.12 136.43,65.31 136.43,39.91 128.81,32.29 85.63,32.29 83.34,30 B1.P$3 82.8,26.67 v71.12,26.67 | v128.81,69.12 125,69.12 123.73,67.85 97.06,67.85 v95.79,66.58 85.63,66.58 81.82,70.39 60.23,70.39 v56.42,66.58 v25.94,66.58 | v128.81,69.12 123.73,74.2 116.11,74.2 v105.95,84.36 106.46,83.85 120.17,83.85 122.46,86.14 122.46,93.25 124.46,95.25 134.7,95.25 136.22,93.73 136.22,89.48 136.18,89.44 136.18,85.12 136.94,84.36 SV2.3 | U$7.VCC 46.83,11.88 47.55,12.6 47.55,14.49 C5.+
  Bottom 0.406: U$9.7 56.55,53.12 55.66,53.12 55.15,53.63 55.15,60.23 55.78,60.87 U$9.1 56.67,63.28 55.91,64.04 C2.1 54.88,65.04 v56.42,66.58 | U$10.7 95.92,53.12 95.28,53.12 94.52,53.88 94.52,60.23 95.16,60.87 U$10.1 96.04,63.28 95.28,64.04 C3.1 94.25,65.04 v95.79,66.58 | U$11.7 126.4,53.12 125.76,53.12 125,53.88 125,60.23 125.64,60.87 U$11.1 126.52,63.28 125.76,64.04 C4.1 125,64.31 125,65.31 v128.81,69.12 | v25.94,66.58 24.4,65.04 C1.1 24.67,64.04 26.19,62.52 U$8.1 26.07,60.74 25.18,60.74 24.67,60.23 24.67,53.88 25.3,53.24 U$8.7 27.91,53.24 30.38,50.77 33.27,50.77 C7.1 33.29,47.79 IC1.5 | R37.2 104.68,85.63 v105.95,84.36 | R38.2 122.46,86.9 119.92,84.36 | 119.92,84.36 v105.95,84.36 | R39.2 138.97,84.36 133.89,84.36 132.62,83.09 121.19,83.09 119.92,84.36 | R31.2 93.25,88.17 97.69,83.72 105.31,83.72 v105.95,84.36 | C6.1 C5.+ 48.26,14.51 | R34.2 R35.2 48.8,13.43 48.26,13.97 47.72,13.97 | 48.26,14.51 50.07,14.51 50.8,15.24 50.8,25.4 49.53,26.67 49.53,29.21 50.8,30.48 67.31,30.48 v71.12,26.67 | 47.55,13.97 47.72,13.97 | 47.72,13.97 48.26,14.51